# EAGLE design BeagleBone Arduino Cape (EAGLE 6.4)
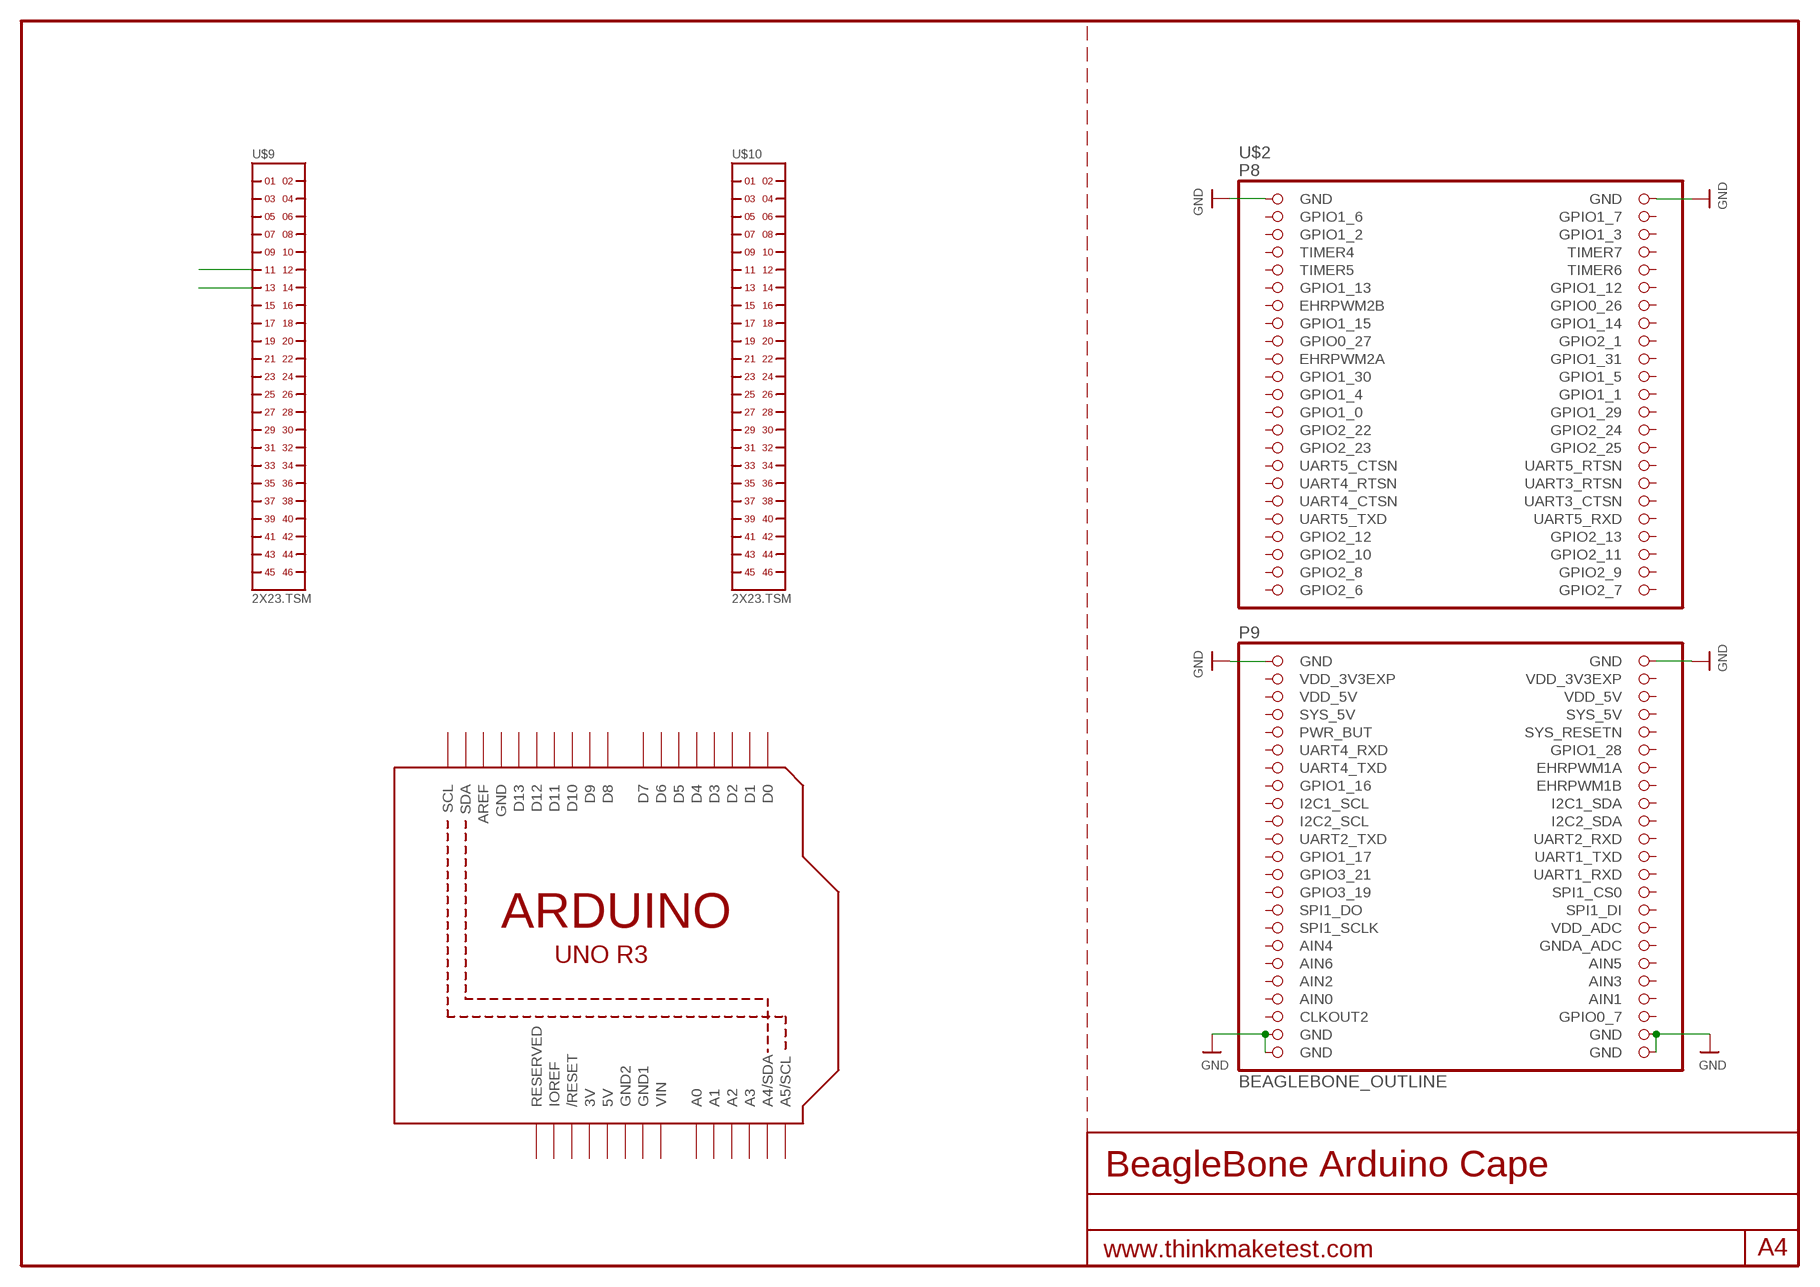
[diagram p0: schematic, sheet 1]

## Parts
U1  ARDUINOR3-BPLACE  [ARDUINOR3-BPLACE]
U$2  BEAGLEBONE_OUTLINE  [BEAGLEBONE_SHIELD]
U$9  2X23.TSM  [TSM-123-XX-XXX-DV]
U$10  2X23.TSM  [TSM-123-XX-XXX-DV]

## Nets
GND: U$2.1(GND) U$2.2(GND) U$2.47(GND) U$2.48(GND) U$2.89(GND) U$2.90(GND) U$2.91(GND) U$2.92(GND)
N$1: U$9.11
N$2: U$9.13
Unconnected: U1.A0 U1.A1 U1.A2 U1.A3 U1.A4(A4/SDA) U1.A5(A5/SCL) U1.AREF U1.D0 U1.D1 U1.D2 U1.D3 U1.D4 U1.D5 U1.D6 U1.D7 U1.D8 U1.D9 U1.D10 U1.D11 U1.D12 U1.D13 U1.IOREF U1.RESERVED U1.RESET(/RESET) U1.SCL U1.SDA U$2.3(GPIO1_6) U$2.4(GPIO1_7) U$2.5(GPIO1_2) U$2.6(GPIO1_3) U$2.7(TIMER4) U$2.8(TIMER7) U$2.9(TIMER5) U$2.10(TIMER6) U$2.11(GPIO1_13) U$2.12(GPIO1_12) U$2.13(EHRPWM2B) U$2.14(GPIO0_26) U$2.15(GPIO1_15) U$2.16(GPIO1_14) U$2.17(GPIO0_27) U$2.18(GPIO2_1) U$2.19(EHRPWM2A) U$2.20(GPIO1_31) U$2.21(GPIO1_30) U$2.22(GPIO1_5) U$2.23(GPIO1_4) U$2.24(GPIO1_1) U$2.25(GPIO1_0) U$2.26(GPIO1_29) U$2.27(GPIO2_22) U$2.28(GPIO2_24) U$2.29(GPIO2_23) U$2.30(GPIO2_25) U$2.31(UART5_CTSN) U$2.32(UART5_RTSN) U$2.33(UART4_RTSN) U$2.34(UART3_RTSN) U$2.35(UART4_CTSN) U$2.36(UART3_CTSN) U$2.37(UART5_TXD) U$2.38(UART5_RXD) U$2.39(GPIO2_12) U$2.40(GPIO2_13) U$2.41(GPIO2_10) U$2.42(GPIO2_11) U$2.43(GPIO2_8) U$2.44(GPIO2_9) U$2.45(GPIO2_6) U$2.46(GPIO2_7) U$2.54(SYS_5V) U$2.55(PWR_BUT) U$2.56(SYS_RESETN) U$2.57(UART4_RXD) U$2.58(GPIO1_28) U$2.59(UART4_TXD) U$2.60(EHRPWM1A) U$2.61(GPIO1_16) U$2.62(EHRPWM1B) U$2.63(I2C1_SCL) U$2.64(I2C1_SDA) U$2.65(I2C2_SCL) U$2.66(I2C2_SDA) U$2.67(UART2_TXD) U$2.68(UART2_RXD) U$2.69(GPIO1_17) U$2.70(UART1_TXD) U$2.71(GPIO3_21) U$2.72(UART1_RXD) U$2.73(GPIO3_19) U$2.74(SPI1_CS0) U$2.75(SPI1_DO) U$2.76(SPI1_DI) U$2.77(SPI1_SCLK) U$2.78(VDD_ADC) U$2.79(AIN4) U$2.80(GNDA_ADC) U$2.81(AIN6) U$2.82(AIN5) U$2.83(AIN2) U$2.84(AIN3) U$2.86(AIN1) U$2.87(CLKOUT2) U$2.88(GPIO0_7) U$9.1 U$9.2 U$9.3 U$9.4 U$9.5 U$9.6 U$9.7 U$9.8 U$9.9 U$9.10 U$9.12 U$9.14 U$9.15 U$9.16 U$9.17 U$9.18 U$9.19 U$9.20 U$9.21 U$9.22 U$9.23 U$9.24 U$9.25 U$9.26 U$9.27 U$9.28 U$9.29 U$9.30 U$9.31 U$9.32 U$9.33 U$9.34 U$9.35 U$9.36 U$9.37 U$9.38 U$9.39 U$9.40 U$9.41 U$9.42 U$9.43 U$9.44 U$9.45 U$9.46 U$10.1 U$10.2 U$10.3 U$10.4 U$10.5 U$10.6 U$10.7 U$10.8 U$10.9 U$10.10 U$10.11 U$10.12 U$10.13 U$10.14 U$10.15 U$10.16 U$10.17 U$10.18 U$10.19 U$10.20 U$10.21 U$10.22 U$10.23 U$10.24 U$10.25 U$10.26 U$10.27 U$10.28 U$10.29 U$10.30 U$10.31 U$10.32 U$10.33 U$10.34 U$10.35 U$10.36 U$10.37 U$10.38 U$10.39 U$10.40 U$10.41 U$10.42 U$10.43 U$10.44 U$10.45 U$10.46

## Power pins joined to a net without a drawn wire
3V: U1.3V
5V: U1.5V
AIN0: U$2.85(AIN0)
GND: U1.GND
GND1: U1.GND1
GND2: U1.GND2
SYS_5V: U$2.53(SYS_5V)
VDD_3V3EXP: U$2.49(VDD_3V3EXP) U$2.50(VDD_3V3EXP)
VDD_5V: U$2.51(VDD_5V) U$2.52(VDD_5V)
VIN: U1.VIN

## Library data of the parts
U1 = adafruit:ARDUINOR3: This is a new object for the new Arduino R3 - with extra pins that you may want to use (such as IOref, and duplicated A4/A5
U$2 = adafruit:BEAGLEBONE_OUTLINE: Should match A3 pinout - but not completely tested
U$9 U$10 = headers(.1in)(samtec):2X23

## Board
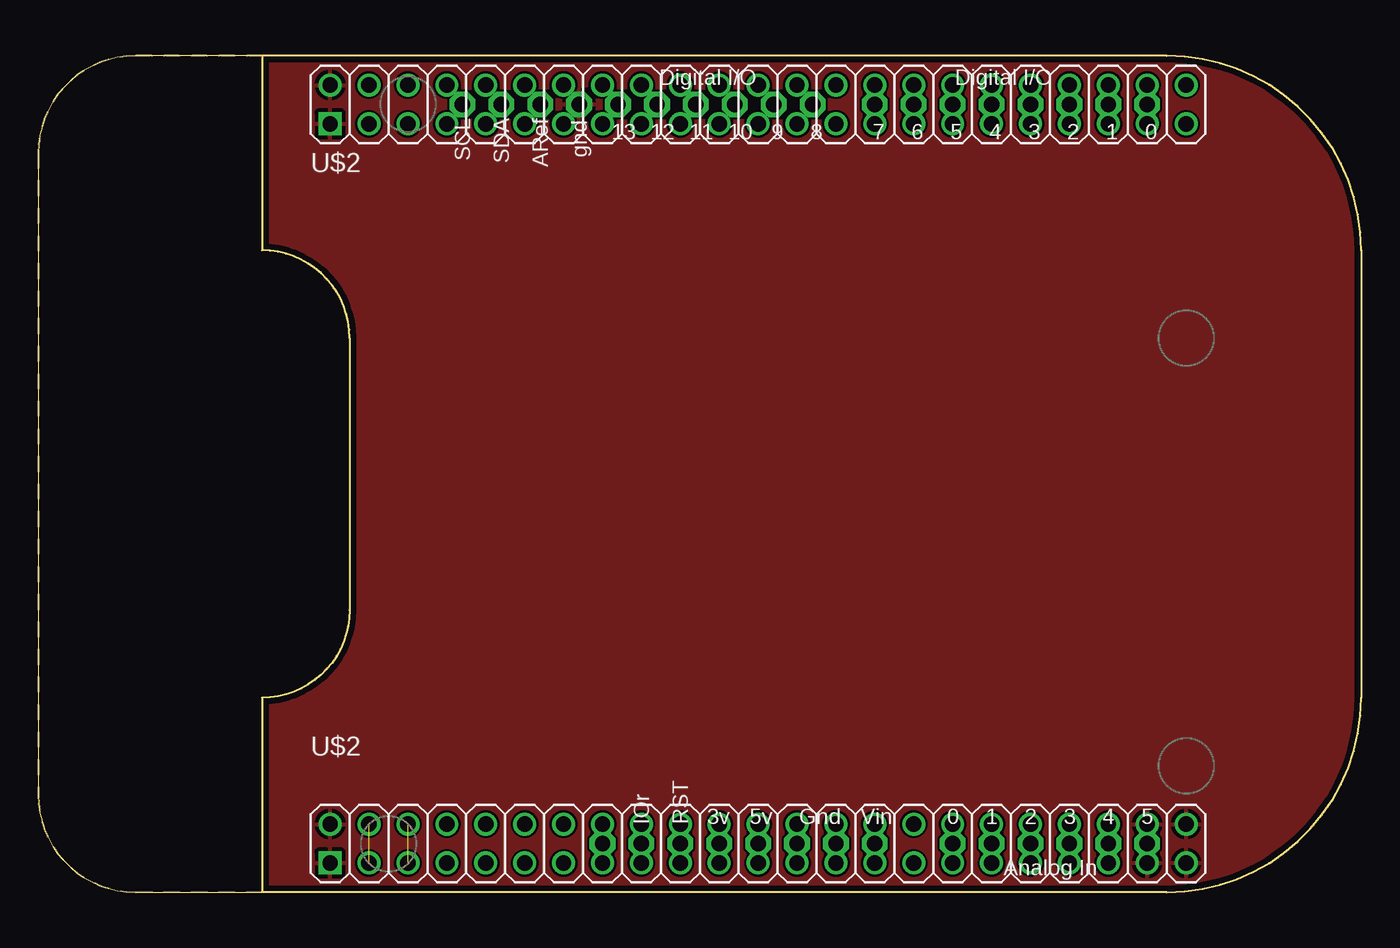
[diagram p1: board, top side]
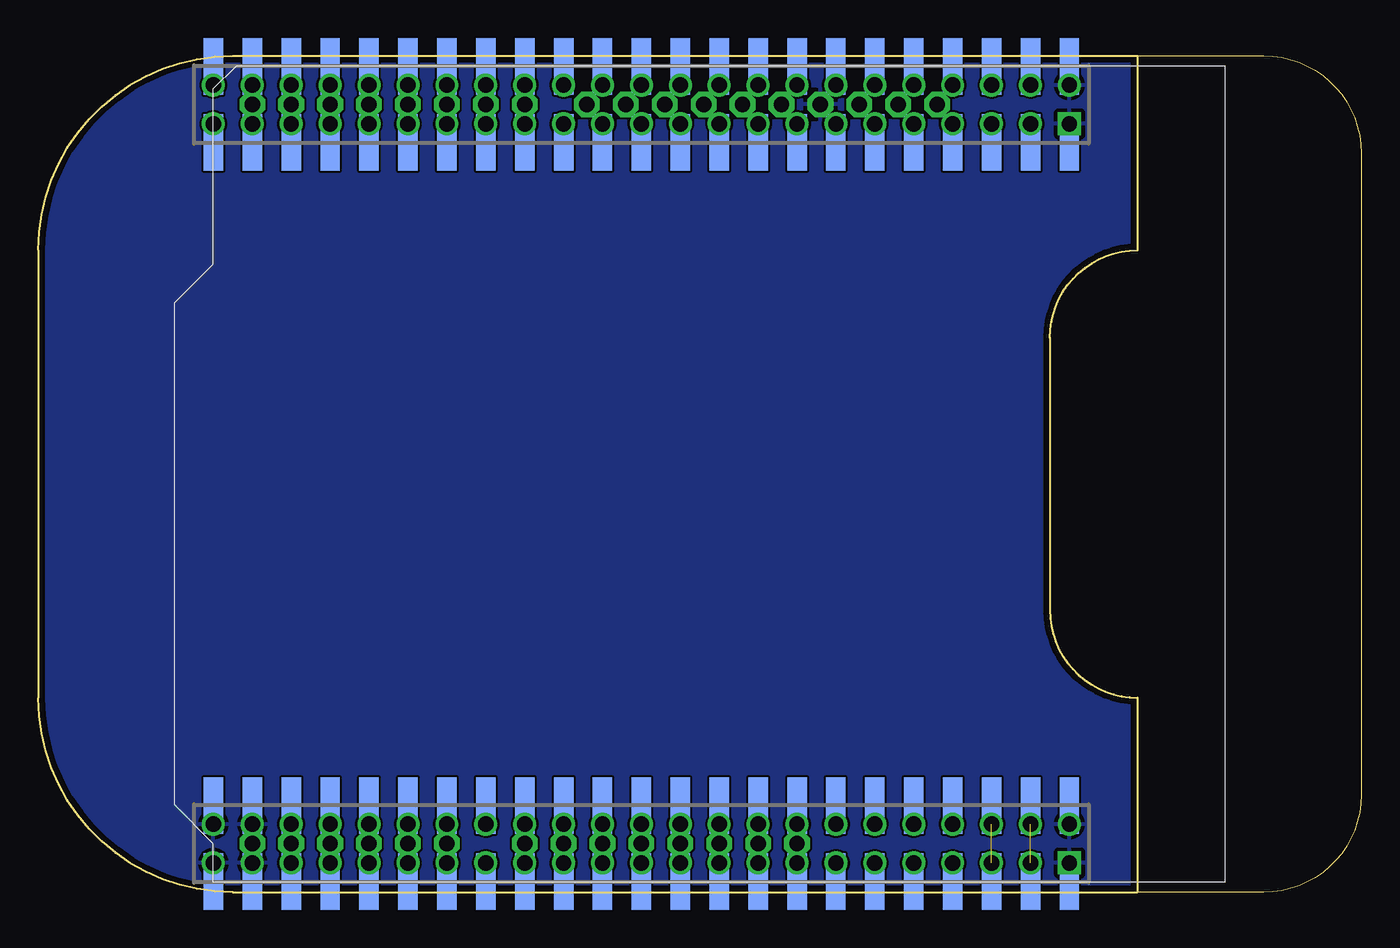
[diagram p2: board, bottom side, seen from below]

Size 86.36 x 54.61 mm. Coordinates in mm from the lower left corner, seen from the top.
Outline: 0,48.26 0,6.35 arc90 6.35,0 73.66,0 arc90 86.36,12.7 86.36,41.91 arc90 73.66,54.61 6.35,54.61 arc90 0,48.26
Copper layers (1*16): Top 0.0356mm / dielectric 1.5011mm / Bottom 0.0356mm
Design rules "OSHPark": minimum track width 6mil, minimum drill 13mil, track to track 6mil, track to pad 6mil, pad to pad 6mil, via to via 6mil, smd to smd 6mil, copper to edge 15mil, drill to drill 6mil, minimum pad ring 7mil, minimum via ring 7mil, stop-mask expansion 4mil, vias tented up to drill 16mil, thermal gap 10mil

### Footprints (pad centres in the part's own frame; a part is rotated, then mirrored left to right if it is on the bottom)
ARDUINOR3-BPLACE = drill 1 pad 1.676 octagon: 3V 35.56,2.54; 5V 38.1,2.54; A0 50.8,2.54; A1 53.34,2.54; A2 55.88,2.54; A3 58.42,2.54; A4 60.96,2.54; A5 63.5,2.54; AREF 23.876,50.8; D0 63.5,50.8; D1 60.96,50.8; D2 58.42,50.8; D3 55.88,50.8; D4 53.34,50.8; D5 50.8,50.8; D6 48.26,50.8; D7 45.72,50.8; D8 41.656,50.8; D9 39.116,50.8; D10 36.576,50.8; D11 34.036,50.8; D12 31.496,50.8; D13 28.956,50.8; GND 26.416,50.8; GND1 43.18,2.54; GND2 40.64,2.54; IOREF 30.48,2.54; RESERVED 27.94,2.54; RESET 33.02,2.54; SCL 18.796,50.8; SDA 21.336,50.8; VIN 45.72,2.54
BEAGLEBONE_SHIELD = drill 1 square: 1 4.445,19.05; 47 52.705,19.05 | drill 1: 2 1.905,19.05; 3 4.445,21.59; 4 1.905,21.59; 5 4.445,24.13; 6 1.905,24.13; 7 4.445,26.67; 8 1.905,26.67; 9 4.445,29.21; 10 1.905,29.21; 11 4.445,31.75; 12 1.905,31.75; 13 4.445,34.29; 14 1.905,34.29; 15 4.445,36.83; 16 1.905,36.83; 17 4.445,39.37; 18 1.905,39.37; 19 4.445,41.91; 20 1.905,41.91; 21 4.445,44.45; 22 1.905,44.45; 23 4.445,46.99; 24 1.905,46.99; 25 4.445,49.53; 26 1.905,49.53; 27 4.445,52.07; 28 1.905,52.07; 29 4.445,54.61; 30 1.905,54.61; 31 4.445,57.15; 32 1.905,57.15; 33 4.445,59.69; 34 1.905,59.69; 35 4.445,62.23; 36 1.905,62.23; 37 4.445,64.77; 38 1.905,64.77; 39 4.445,67.31; 40 1.905,67.31; 41 4.445,69.85; 42 1.905,69.85; 43 4.445,72.39; 44 1.905,72.39; 45 4.445,74.93; 46 1.905,74.93; 48 50.165,19.05; 49 52.705,21.59; 50 50.165,21.59; 51 52.705,24.13; 52 50.165,24.13; 53 52.705,26.67; 54 50.165,26.67; 55 52.705,29.21; 56 50.165,29.21; 57 52.705,31.75; 58 50.165,31.75; 59 52.705,34.29; 60 50.165,34.29; 61 52.705,36.83; 62 50.165,36.83; 63 52.705,39.37; 64 50.165,39.37; 65 52.705,41.91; 66 50.165,41.91; 67 52.705,44.45; 68 50.165,44.45; 69 52.705,46.99; 70 50.165,46.99; 71 52.705,49.53; 72 50.165,49.53; 73 52.705,52.07; 74 50.165,52.07; 75 52.705,54.61; 76 50.165,54.61; 77 52.705,57.15; 78 50.165,57.15; 79 52.705,59.69; 80 50.165,59.69; 81 52.705,62.23; 82 50.165,62.23; 83 52.705,64.77; 84 50.165,64.77; 85 52.705,67.31; 86 50.165,67.31; 87 52.705,69.85; 88 50.165,69.85; 89 52.705,72.39; 90 50.165,72.39; 91 52.705,74.93; 92 50.165,74.93
TSM-123-XX-XXX-DV = smd 1.27 x 3.683: 1 -27.94,-2.477; 2 -27.94,2.477; 3 -25.4,-2.477; 4 -25.4,2.477; 5 -22.86,-2.477; 6 -22.86,2.477; 7 -20.32,-2.477; 8 -20.32,2.477; 9 -17.78,-2.477; 10 -17.78,2.477; 11 -15.24,-2.477; 12 -15.24,2.477; 13 -12.7,-2.477; 14 -12.7,2.477; 15 -10.16,-2.477; 16 -10.16,2.477; 17 -7.62,-2.477; 18 -7.62,2.477; 19 -5.08,-2.477; 20 -5.08,2.477; 21 -2.54,-2.477; 22 -2.54,2.477; 23 0,-2.477; 24 0,2.477; 25 2.54,-2.477; 26 2.54,2.477; 27 5.08,-2.477; 28 5.08,2.477; 29 7.62,-2.477; 30 7.62,2.477; 31 10.16,-2.477; 32 10.16,2.477; 33 12.7,-2.477; 34 12.7,2.477; 35 15.24,-2.477; 36 15.24,2.477; 37 17.78,-2.477; 38 17.78,2.477; 39 20.32,-2.477; 40 20.32,2.477; 41 22.86,-2.477; 42 22.86,2.477; 43 25.4,-2.477; 44 25.4,2.477; 45 27.94,-2.477; 46 27.94,2.477

### Placement (x,y rotation side)
U1  8.89,0.64 0 top
U$2  0,54.61 270 top
U$9  46.99,51.44 0 bottom
U$10  46.99,3.17 0 bottom

### Tracks (layer width: path | path; a pad name or v marks a point on that pad's centre or on a via)
GND
  pour Bottom: 0,0 86.36,0 86.36,54.61 0,54.61
  pour Top: 0,0 86.36,0 86.36,54.61 0,54.61
VDD_3V3EXP  (1 unrouted)
VDD_5V  (1 unrouted)